# EasyEDA Pro project e_oct_dice_Dec_2022.eprj, schematic e_oct_dice_sch_v0_2_alpha
Create Date: 2022-12-15; Page Name: P1; Project Name: e_oct_dice_Dec_2022; Schematic Name: e_oct_dice_sch; Update Date: 2022-12-20; Company: CC BY-SA 4.0 International; Drawed: RONG BAO; Page Size: A4; Part Number: P1; Reviewed: RONG BAO; Version: v0.2-alpha
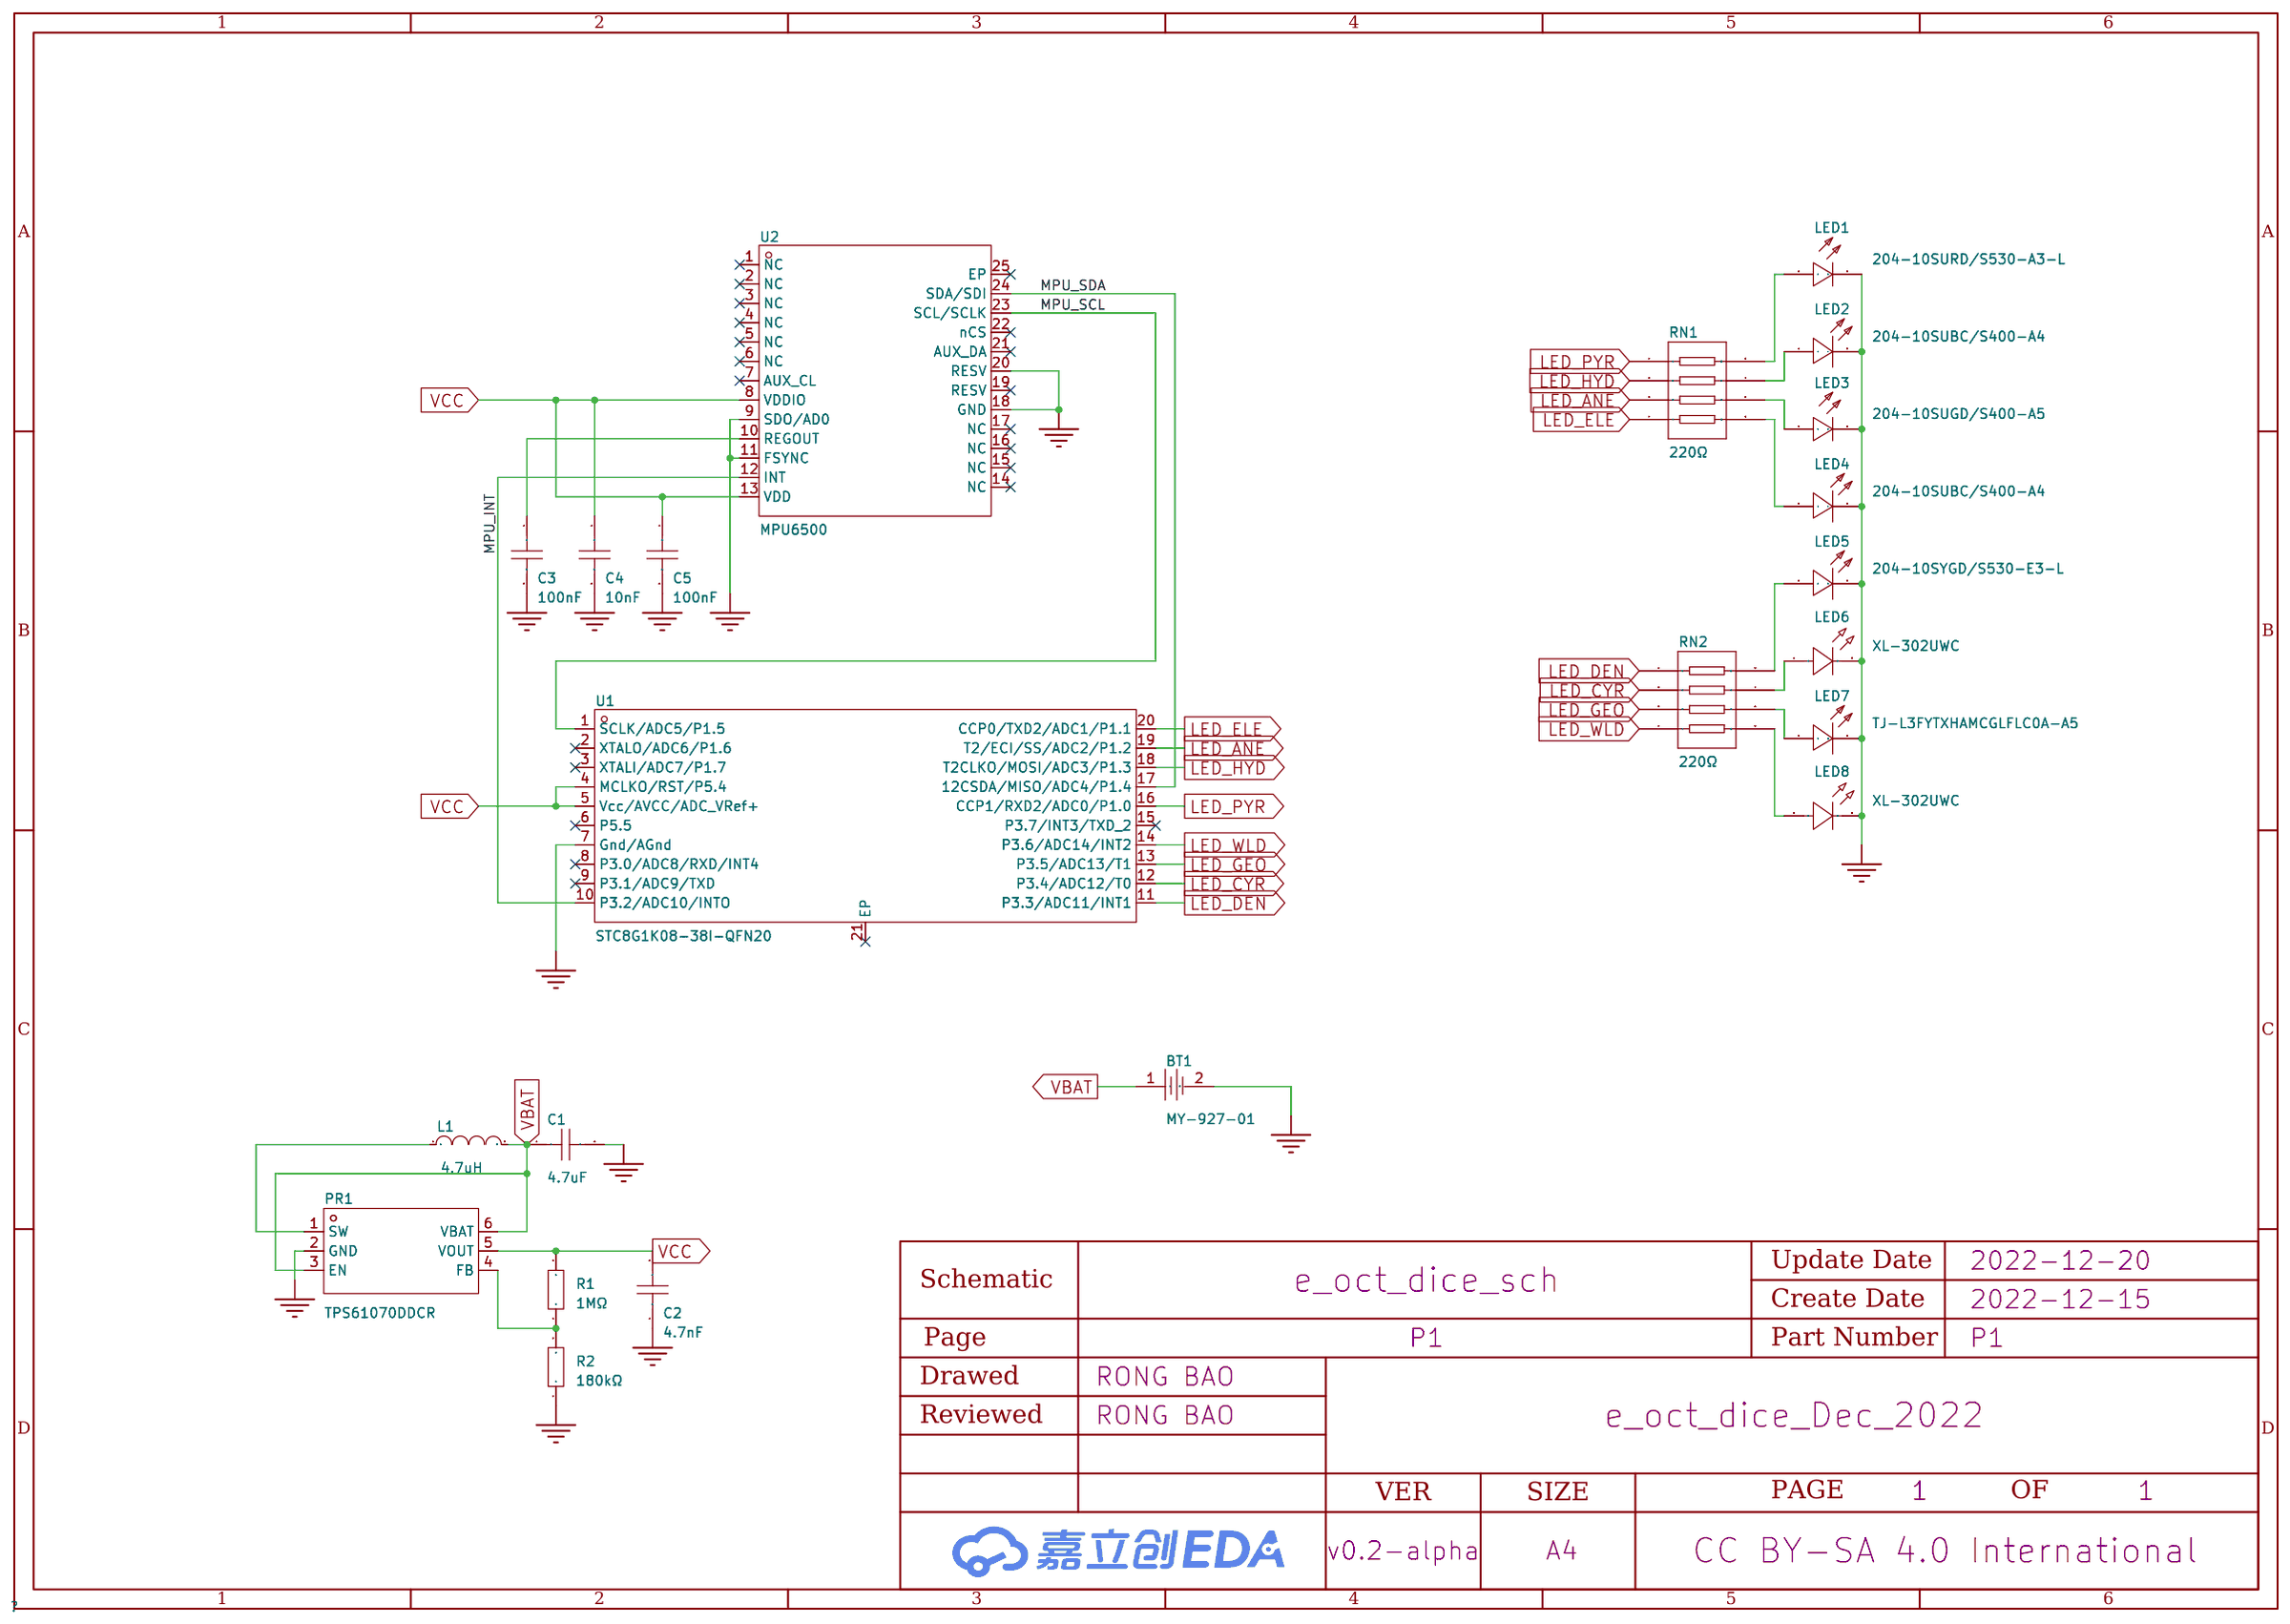
[diagram p0: schematic sheet]

## Parts
BT1  MY-927-01  [BAT-TH_MY-927-01]
C1  4.7uF  [C0402]
C2  4.7nF  [C0402]
C3  100nF  [C0402_NEW]
C4  10nF  [C0402]
C5  100nF  [C0402_NEW]
L1  4.7uH  [L0603]
LED1  204-10SURD/S530-A3-L  [LED-TH_BD3.0-P2.54-FD]
LED2  204-10SUBC/S400-A4  [LED-TH_BD4.0-P2.54-FD]
LED3  204-10SUGD/S400-A5  [LED-TH_BD3.0-P2.54-FD]
LED4  204-10SUBC/S400-A4  [LED-TH_BD4.0-P2.54-FD]
LED5  204-10SYGD/S530-E3-L  [LED-TH_BD3.0-P2.54-FD]
LED6  XL-302UWC  [LED-TH_BD3.8-P2.54-FD_WHITE]
LED7  TJ-L3FYTXHAMCGLFLC0A-A5  [LED-TH_BD3.0-P2.54-FD]
LED8  XL-302UWC  [LED-TH_BD3.8-P2.54-FD_WHITE]
PR1  TPS61070DDCR  [SOT-23-6_L2.9-W1.6-P0.95-LS2.8-BR]
R1  1MΩ  [R0402]
R2  180kΩ  [R0402]
RN1  220Ω  [RES-ARRAY-SMD_0402-8P-L2.0-W1.0-BL]
RN2  220Ω  [RES-ARRAY-SMD_0402-8P-L2.0-W1.0-BL]
U1  STC8G1K08-38I-QFN20  [TQFN-20L_L3.0-W3.0-P0.40-BL-EP]
U2  MPU6500  [QFN-24_L3.0-W3.0-P0.40-BL-EP]

## Library data of the parts
BT1 = MY-927-01: 连接器类型:电池扣;适用电池规格:CR927;工作温度范围:-;; LCSC Part Name: 电池扣 适用电池:CR927; Supplier Part: C964850; Manufacturer: MYOUNG(美阳); Supplier Footprint: 插件; JLCPCB Part Class: Extended Part; Datasheet: https://atta.szlcsc.com/upload/public/pdf/source/20201218/C964850_48FDFDE1A9A12212C9EC07C1F9ECA79B.pdf; Supplier: LCSC; Connector Type: 电池扣; Battery Type: CR927
C1 = CL05A475MP5NRNC: 容值:4.7uF;精度:±20%;额定电压:10V;材质(温度系数):X5R;; LCSC Part Name: 4.7uF ±20% 10V; Supplier Part: C23733; Manufacturer: SAMSUNG(三星); Supplier Footprint: 0402; JLCPCB Part Class: Basic Part; Datasheet: https://atta.szlcsc.com/upload/public/pdf/source/20160103/1457707710457.pdf; Supplier: LCSC; Tolerance: ±20%; Voltage Rated: 10V; Temperature Coefficient: X5R
C2 = CL05B472KB5NNNC: 容值:4.7nF;精度:±10%;额定电压:50V;材质(温度系数):X7R;; LCSC Part Name: 4.7nF ±10% 50V; Supplier Part: C84705; Manufacturer: SAMSUNG(三星); Supplier Footprint: 0402; JLCPCB Part Class: Extended Part; Datasheet: https://atta.szlcsc.com/upload/public/pdf/source/20180326/C84705_84DF2F37A158DEF34B03AEE00F973AA3.pdf; Supplier: LCSC; Tolerance: ±10%; Voltage Rated: 50V; Temperature Coefficient: X7R
C3 C5 = CL05B104KO5NNNC: 容值:100nF;精度:±10%;额定电压:16V;材质(温度系数):X7R;; LCSC Part Name: 100nF ±10% 16V; Supplier Part: C1525; Manufacturer: SAMSUNG(三星); Supplier Footprint: 0402; JLCPCB Part Class: Basic Part; Datasheet: https://atta.szlcsc.com/upload/public/pdf/source/20160103/1457707674891.pdf; Supplier: LCSC; Tolerance: ±10%; Voltage Rated: 16V; Temperature Coefficient: X7R
C4 = CL05B103KB5NNNC: 容值:10nF;精度:±10%;额定电压:50V;材质(温度系数):X7R;; LCSC Part Name: 10nF ±10% 50V; Supplier Part: C15195; Manufacturer: SAMSUNG(三星); Supplier Footprint: 0402; JLCPCB Part Class: Basic Part; Datasheet: https://atta.szlcsc.com/upload/public/pdf/source/20160103/1457707674468.pdf; Supplier: LCSC; Tolerance: ±10%; Voltage Rated: 50V; Temperature Coefficient: X7R
L1 = SDFL1608Q4R7KTF: 电感值:4.7uH;精度:±10%;额定电流:15mA;饱和电流(Isat):-;直流电阻(DCR):2.1Ω;; LCSC Part Name: 4.7uH ±10% 2.1Ω; Supplier Part: C1034; Manufacturer: Sunlord(顺络); Supplier Footprint: 0603; JLCPCB Part Class: Basic Part; Datasheet: https://atta.szlcsc.com/upload/public/pdf/source/20210816/855F4348312D259031B87CBCF31BE802.pdf; Supplier: LCSC; Tolerance: ±10%; Rated Current: 15mA; DC Resistance (DCR): 2.1Ω; Q @ Freq: 35@10MHz; Frequency - Self Resonant: 10MHz
LED1 = 204-10SURD/S530-A3-L: 发光颜色:红灯;二极管配置:-;透镜颜色:雾状红;主波长:624nm;峰值波长:632nm;色温:-;测试电流:20mA;功率:60mW;发光角度:40°;安装方式:-;工作温度:-40℃~+85℃;; LCSC Part Name: 红灯 624nm; Supplier Part: C99771; Manufacturer: EVERLIGHT(亿光); Supplier Footprint: 直插,P=2.54mm; JLCPCB Part Class: Extended Part; Datasheet: https://atta.szlcsc.com/upload/public/pdf/source/20170504/1493866972127.pdf; Supplier: LCSC; Emitted Color: 红灯; Lens Color: 雾状红; Dominant Wavelength: 624nm; Peak Wavelength: 632nm; Forward Current: 20mA; Power Dissipation: 60mW; Viewing Angle: 40°; Operating Temperature: -40℃~+85℃; Lamp Holder Type: 3mm圆形灯头
LED2 LED4 = 204-10SUBC/S400-A4: 发光颜色:蓝灯;; LCSC Part Name: 蓝灯; Supplier Part: C86881; Manufacturer: EVERLIGHT(亿光); Supplier Footprint: 插件,D=3mm; JLCPCB Part Class: Extended Part; Datasheet: https://atta.szlcsc.com/upload/public/pdf/source/20170105/1483610751739.pdf; Supplier: LCSC; Emitted Color: 蓝灯; Lamp Holder Type: 3mm圆形灯头
LED3 = 204-10SUGD/S400-A5: 发光颜色:翠绿;二极管配置:-;透镜颜色:雾状绿;主波长:530nm;峰值波长:525nm;色温:-;测试电流:20mA;功率:110mW;发光角度:30°;安装方式:-;工作温度:-40℃~+85℃;; LCSC Part Name: 翠绿 530nm; Supplier Part: C99761; Manufacturer: EVERLIGHT(亿光); Supplier Footprint: 插件,D=3mm; JLCPCB Part Class: Extended Part; Datasheet: https://atta.szlcsc.com/upload/public/pdf/source/20190311/C99761_45F71091A0F073B983B2689408558B89.pdf; Supplier: LCSC; Emitted Color: 翠绿; Lens Color: 雾状绿; Dominant Wavelength: 530nm; Peak Wavelength: 525nm; Forward Current: 20mA; Power Dissipation: 110mW; Viewing Angle: 30°; Operating Temperature: -40℃~+85℃; Lamp Holder Type: 3mm圆形灯头
LED5 = 204-10SYGD/S530-E3-L: 发光颜色:普绿/黄绿;; LCSC Part Name: 普绿/黄绿; Supplier Part: C128785; Manufacturer: EVERLIGHT(亿光); Supplier Footprint: 直插,P=2.54mm; JLCPCB Part Class: Extended Part; Datasheet: https://atta.szlcsc.com/upload/public/pdf/source/20170914/C128785_1505359863627968031.pdf; Supplier: LCSC; Emitted Color: 普绿/黄绿; Lamp Holder Type: 3mm圆形灯头
LED6 LED8 = XL-302UWC: 发光颜色:白灯;透镜颜色:无色透明;色温:6000K~6500K;测试电流:20mA;功率:80mW;发光角度:50°;安装方式:-;工作温度:-25℃~+85℃;; LCSC Part Name: 白灯 6000K~6500K; Supplier Part: C2895458; Manufacturer: XINGLIGHT(成兴光); Supplier Footprint: 插件,D=3mm; JLCPCB Part Class: Extended Part; Datasheet: https://atta.szlcsc.com/upload/public/pdf/source/20220816/95DCBD942C61C750E3165A46E2F97F4A.pdf; Supplier: LCSC; Emitted Color: 白灯; Lens Color: 无色透明; Color Temperature: 6000K~6500K; Forward Current: 20mA; Power Dissipation: 80mW; Viewing Angle: 50°; Operating Temperature: -25℃~+85℃; Lamp Holder Type: 3mm圆形灯头
LED7 = TJ-L3FYTXHAMCGLFLC0A-A5: 发光颜色:橙灯;透镜颜色:雾状橙;; LCSC Part Name: 橙灯; Supplier Part: C330758; Manufacturer: TOGIALED(统佳); Supplier Footprint: 插件,D=3mm; JLCPCB Part Class: Extended Part; Datasheet: https://atta.szlcsc.com/upload/public/pdf/source/20200630/C330758_4D45038C78DDB483BDC1D97AAE81DE0C.pdf; Supplier: LCSC; Emitted Color: 橙灯; Lens Color: 雾状橙; Lamp Holder Type: 3mm圆形灯头
PR1 = TPS61070DDCR: 功能类型:升压型;同步整流:是;输出类型:可调;输出通道数:1;拓扑结构:升压式;输入电压:0.9V~5.5V;输出电压:1.8V~5.5V;输出电流(最大值):500mA;开关频率:1.2MHz;工作温度:-40℃~+85℃@(TA);; LCSC Part Name: 升压型 Vin=0.9V~5.5V Vout=1.8V~5.5V 500mA; Supplier Part: C9841; Manufacturer: TI(德州仪器); Supplier Footprint: SOT-23-6; JLCPCB Part Class: Extended Part; Datasheet: https://atta.szlcsc.com/upload/public/pdf/source/20121108/1457706555598.pdf; Supplier: LCSC; Function: 升压型; Synchronous Rectification: 是; Output Type: 可调; Number of Outputs: 1; Topology: 升压式; Input Voltage: 0.9V~5.5V; Output Voltage: 1.8V~5.5V; Output Current (Max): 500mA; Switching Frequency: 1.2MHz; Operating Temperature: -40℃~+85℃@(TA)
R1 = 0402WGF1004TCE: 电阻类型:厚膜电阻;阻值:1MΩ;精度:±1%;功率:62.5mW;温度系数:±100ppm/℃;最大工作电压:50V;工作温度范围:-55℃~+155℃;; LCSC Part Name: 1MΩ ±1% 62.5mW; Supplier Part: C26083; Manufacturer: UNI-ROYAL(厚声); Supplier Footprint: 0402; JLCPCB Part Class: Basic Part; Datasheet: https://atta.szlcsc.com/upload/public/pdf/source/20200306/C422600_1E6D84923E4A46A82E41ADD87F860B5C.pdf; Supplier: LCSC; Type: 厚膜电阻; Tolerance: ±1%; Power(Watts): 62.5mW; Temperature Coefficient: ±100ppm/℃; Overload Voltage (Max): 50V; Operating Temperature Range: -55℃~+155℃
R2 = 0402WGF1803TCE: 电阻类型:厚膜电阻;阻值:180kΩ;精度:±1%;功率:62.5mW;温度系数:±100ppm/℃;最大工作电压:50V;工作温度范围:-55℃~+155℃;; LCSC Part Name: 180kΩ ±1% 62.5mW; Supplier Part: C25760; Manufacturer: UNI-ROYAL(厚声); Supplier Footprint: 0402; JLCPCB Part Class: Extended Part; Datasheet: https://atta.szlcsc.com/upload/public/pdf/source/20200306/C422600_1E6D84923E4A46A82E41ADD87F860B5C.pdf; Supplier: LCSC; Type: 厚膜电阻; Tolerance: ±1%; Power(Watts): 62.5mW; Temperature Coefficient: ±100ppm/℃; Overload Voltage (Max): 50V; Operating Temperature Range: -55℃~+155℃
RN1 RN2 = RTA02-4D221JTH: 阻值:220Ω;精度:±5%;单个元件功率:62.5mW;温度系数:±200ppm/℃;电阻器数:4;引脚数:8;; LCSC Part Name: 220Ω ±5% 0402x4; Supplier Part: C102633; Manufacturer: RALEC(旺诠); Supplier Footprint: 0402x4; JLCPCB Part Class: Extended Part; Datasheet: https://atta.szlcsc.com/upload/public/pdf/source/20170408/1491642544937.pdf; Supplier: LCSC; Tolerance: ±5%; Power(Watts): 62.5mW; Temperature Coefficient: ±200ppm/℃; Number of Resistors: 4; Number of Pins: 8
U1 = STC8G1K08-38I-QFN20: CPU内核:51系列;CPU最大主频:-;工作电压范围:1.9V~5.5V;内部振荡器:有;外部时钟频率范围:4MHz~33MHz;程序 FLASH容量:8KB;RAM总容量:1.25KB;EEPROM/数据 FLASH容量:1KB;GPIO端口数量:18;ADC(单元数/通道数/位数):1@x15ch/10bit;DAC(单元数/通道数/位数):-;(E)PWM(单元数/通道数/位数):-;8位Timer数量:-;16位Timer数量:3;32位Timer数量:-;内部比较器数量:1;U(S)ART路数; Supplier Part: C521758; Manufacturer: STC(宏晶); Supplier Footprint: QFN-20; JLCPCB Part Class: Extended Part; Datasheet: https://atta.szlcsc.com/upload/public/pdf/source/20200427/C521757_3A42F86F9B1410FBC1EBFB2F2384AA9A.pdf; Supplier: LCSC; CPU Core: 51系列; Supply Voltage Range: 1.9V~5.5V; Internal Oscillator: 有; External Clock Frequency Rang: 4MHz~33MHz; Program FLASH Size: 8KB; RAM Size: 1.25KB; EEPROM/Data FLASH Size: 1KB; GPIO Ports Number: 18; ADC (Units/Channels/bits): 1@x15ch/10bit; 16Bit Timer Number: 3; CMP Number: 1; U(S)ART Number: 2; I2C Number: 1; (Q)SPI Number: 1; Peripherals / Functions / Protocol Stacks: 低电压检测；看门狗；CCP捕获/比较; Operating Temperature Range: -40℃~+85℃
U2 = MPU6500: Accelerometer, Gyroscope, 3 Axis Sensor I2C, SPI Output; Supplier Part: C50278; Manufacturer: TDK InvenSense(应美盛); Supplier Footprint: QFN-24; JLCPCB Part Class: Extended Part; Datasheet: https://atta.szlcsc.com/upload/public/pdf/source/20170505/1493957890595.pdf; Supplier: LCSC

## Nets
GND: BT1.2 C1.2 C2.1 C3.2 C4.2 C5.2 LED1.2(K) LED2.2(-) LED3.2(K) LED4.2(-) LED5.2(K) LED6.2(A) LED7.2(C) LED8.2(A) PR1.2(GND) R2.1 U1.7(Gnd/AGnd) U2.9(SDO/AD0) U2.11(FSYNC) U2.18(GND) U2.20(RESV)
VBAT: BT1.1 C1.1 L1.2 PR1.3(EN) PR1.6(VBAT)
VCC: C2.2 C4.1 C5.1 PR1.5(VOUT) R1.2 U1.4(MCLKO/RST/P5.4) U1.5(Vcc/AVCC/ADC_VRef+) U2.8(VDDIO) U2.13(VDD)
LED_ANE: RN1.3 U1.19(T2/ECI/SS/ADC2/P1.2)
LED_CYR: RN2.2 U1.12(P3.4/ADC12/T0)
LED_DEN: RN2.1 U1.11(P3.3/ADC11/INT1)
LED_ELE: RN1.4 U1.20(CCP0/TXD2/ADC1/P1.1)
LED_GEO: RN2.3 U1.13(P3.5/ADC13/T1)
LED_HYD: RN1.2 U1.18(T2CLKO/MOSI/ADC3/P1.3)
LED_PYR: RN1.1 U1.16(CCP1/RXD2/ADC0/P1.0)
LED_WLD: RN2.4 U1.14(P3.6/ADC14/INT2)
MPU_INT: U1.10(P3.2/ADC10/INTO) U2.12(INT)
MPU_SCL: U1.1(SCLK/ADC5/P1.5) U2.23(SCL/SCLK)
MPU_SDA: U1.17(12CSDA/MISO/ADC4/P1.4) U2.24(SDA/SDI)
$1N1768: L1.1 PR1.1(SW)
$1N1911: PR1.4(FB) R1.1 R2.2
$1N2923: C3.1 U2.10(REGOUT)
$1N6086: LED5.1(A) RN2.8
$1N6099: LED6.1(K) RN2.7
$1N6112: LED7.1(A) RN2.6
$1N6141: LED8.1(K) RN2.5
$1N6202: LED1.1(A) RN1.8
$1N6215: LED2.1(+) RN1.7
$1N6228: LED3.1(A) RN1.6
$1N6241: LED4.1(+) RN1.5

Not connected (* = marked no-connect by the designer): U1 2(XTALO/ADC6/P1.6)* 3(XTALI/ADC7/P1.7)* 6(P5.5)* 8(P3.0/ADC8/RXD/INT4)* 9(P3.1/ADC9/TXD)* 15(P3.7/INT3/TXD_2)* 21(EP)*; U2 1(NC)* 2(NC)* 3(NC)* 4(NC)* 5(NC)* 6(NC)* 7(AUX_CL)* 14(NC)* 15(NC)* 16(NC)* 17(NC)* 19(RESV)* 21(AUX_DA)* 22(nCS)* 25(EP)*
